# Altium schematic sheet ESP32-connector.SchDoc: Mobile Robot auxilary connectors
size A4; Date: 9/11/2024; Author: Filip Kulka; DrawnBy: Filip Kulka; DocumentNumber: 2; Revision: 1.0; SheetNumber: 2; SheetTotal: 2; Desc: Auxilary connectors for any outside peripherals; BOM: ESP32_Board - Mobile Robot.BomDoc
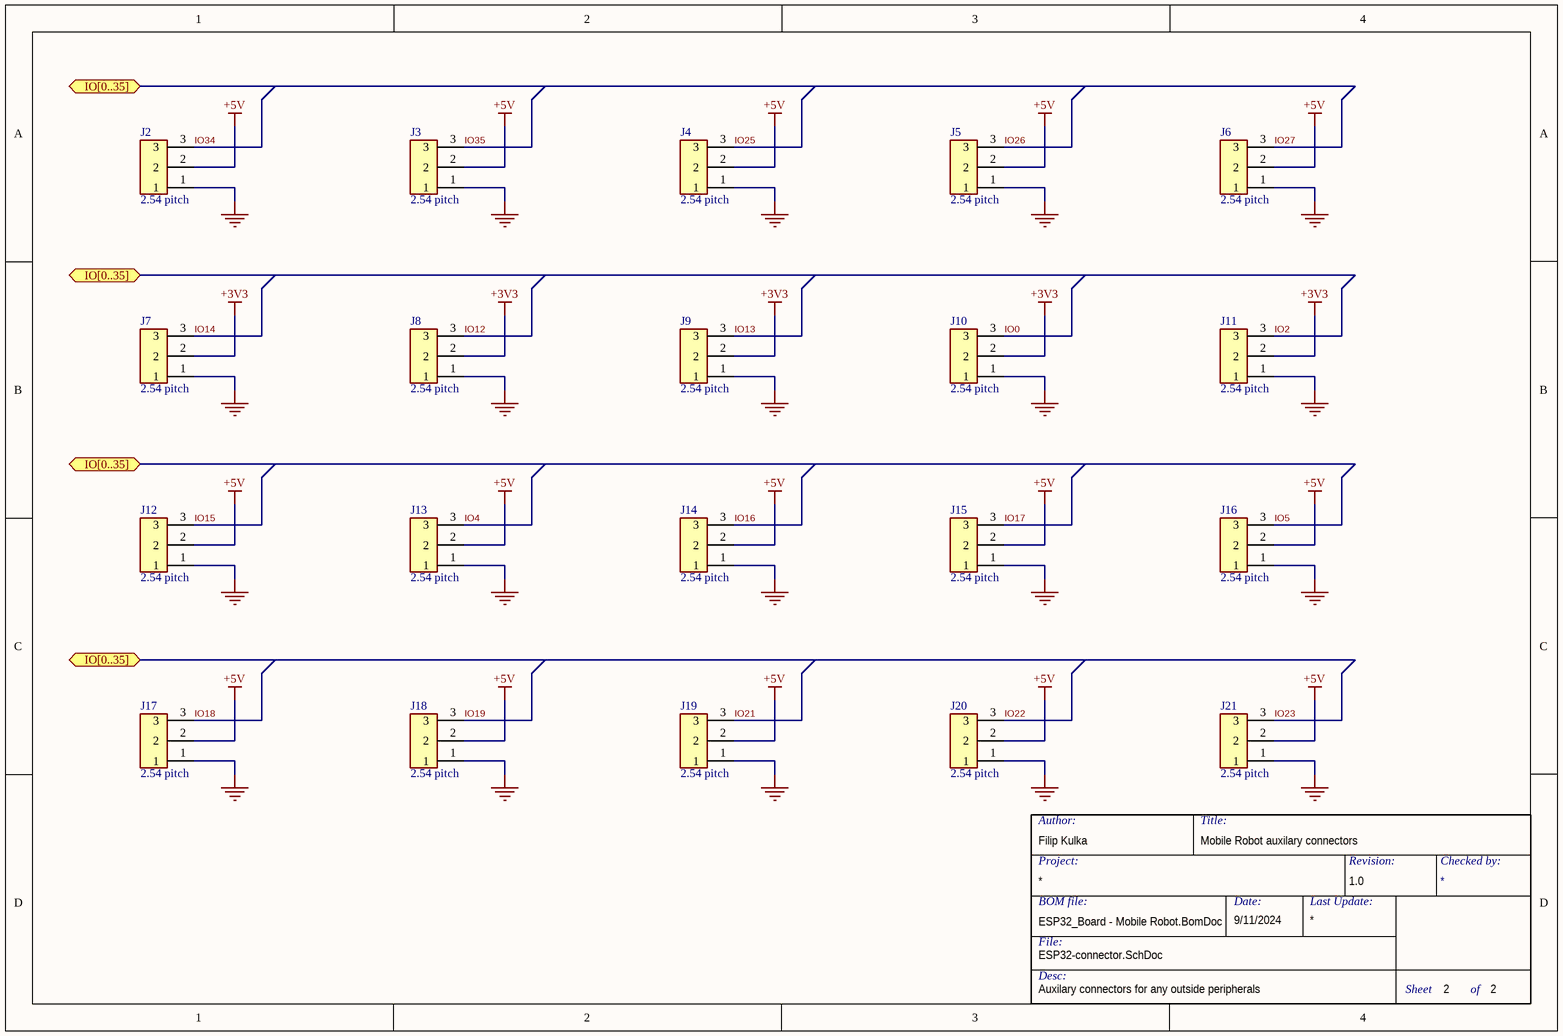
[diagram p0: ESP32-connector.SchDoc]

## Parts
?  (no value)
J2  2.54 pitch  [HDRV3W64P0X254_1X3_762X250X952P]
J3  2.54 pitch  [HDRV3W64P0X254_1X3_762X250X952P]
J4  2.54 pitch  [HDRV3W64P0X254_1X3_762X250X952P]
J5  2.54 pitch  [HDRV3W64P0X254_1X3_762X250X952P]
J6  2.54 pitch  [HDRV3W64P0X254_1X3_762X250X952P]
J7  2.54 pitch  [HDRV3W64P0X254_1X3_762X250X952P]
J8  2.54 pitch  [HDRV3W64P0X254_1X3_762X250X952P]
J9  2.54 pitch  [HDRV3W64P0X254_1X3_762X250X952P]
J10  2.54 pitch  [HDRV3W64P0X254_1X3_762X250X952P]
J11  2.54 pitch  [HDRV3W64P0X254_1X3_762X250X952P]
J12  2.54 pitch  [HDRV3W64P0X254_1X3_762X250X952P]
J13  2.54 pitch  [HDRV3W64P0X254_1X3_762X250X952P]
J14  2.54 pitch  [HDRV3W64P0X254_1X3_762X250X952P]
J15  2.54 pitch  [HDRV3W64P0X254_1X3_762X250X952P]
J16  2.54 pitch  [HDRV3W64P0X254_1X3_762X250X952P]
J17  2.54 pitch  [HDRV3W64P0X254_1X3_762X250X952P]
J18  2.54 pitch  [HDRV3W64P0X254_1X3_762X250X952P]
J19  2.54 pitch  [HDRV3W64P0X254_1X3_762X250X952P]
J20  2.54 pitch  [HDRV3W64P0X254_1X3_762X250X952P]
J21  2.54 pitch  [HDRV3W64P0X254_1X3_762X250X952P]

## Ports
IO[0..35] (bidir, see ESP32-connector[1A], ESP32-connector[1B], ESP32-connector[1C], ESP32_Schematic[3B]), IO[0..35] (bidir, see ESP32-connector[1A], ESP32-connector[1B], ESP32_Schematic[3B]), IO[0..35] (bidir, see ESP32-connector[1B], ESP32-connector[1C], ESP32_Schematic[3B])

## Nets
+3V3: J7.2 J8.2 J9.2 J10.2 J11.2
+5V: J2.2 J3.2 J4.2 J5.2 J6.2 J12.2 J13.2 J14.2 J15.2 J16.2 J17.2 J18.2 J19.2 J20.2 J21.2
GND: J2.1 J3.1 J4.1 J5.1 J6.1 J7.1 J8.1 J9.1 J10.1 J11.1 J12.1 J13.1 J14.1 J15.1 J16.1 J17.1 J18.1 J19.1 J20.1 J21.1
IO0: J10.3
IO2: J11.3
IO4: J13.3
IO5: J16.3
IO12: J8.3
IO13: J9.3
IO14: J7.3
IO15: J12.3
IO16: J14.3
IO17: J15.3
IO18: J17.3
IO19: J18.3
IO21: J19.3
IO22: J20.3
IO23: J21.3
IO25: J4.3
IO26: J5.3
IO27: J6.3
IO34: J2.3
IO35: J3.3

## Notes on the sheet
- Author:
- Title:
- Project:
- BOM file:
- Date:
- Last Update:
- Revision:
- Checked by:
- File:
- Desc:
- Sheet
- of

## Library data of the parts
? = TitleBlock: This is a custom title block with my logo and a bit more info than the default one
J2-J21 = PH1-03-UA: Connector; Manufacturer_Name: Adam Tech; Datasheet Link: https://datasheet.datasheetarchive.com/originals/distributors/Datasheets_SAMA/34c52fbb4019bb4b288b881302863af3.pdf; Height: 9.516mm; Manufacturer_Part_Number: PH1-03-UA; Mouser Part Number: 737-PH1-03-UA; Mouser Price/Stock: https://www.mouser.co.uk/ProductDetail/Adam-Tech/PH1-03-UA?qs=HoCaDK9Nz5cktq3WKneQTQ%3D%3D; Arrow Part Number: PH1-03-UA; Arrow Price/Stock: https://www.arrow.com/en/products/ph1-03-ua/adam-tech?region=nac